# Altium schematic sheet btn_single_V1.0.SchDoc
size A4
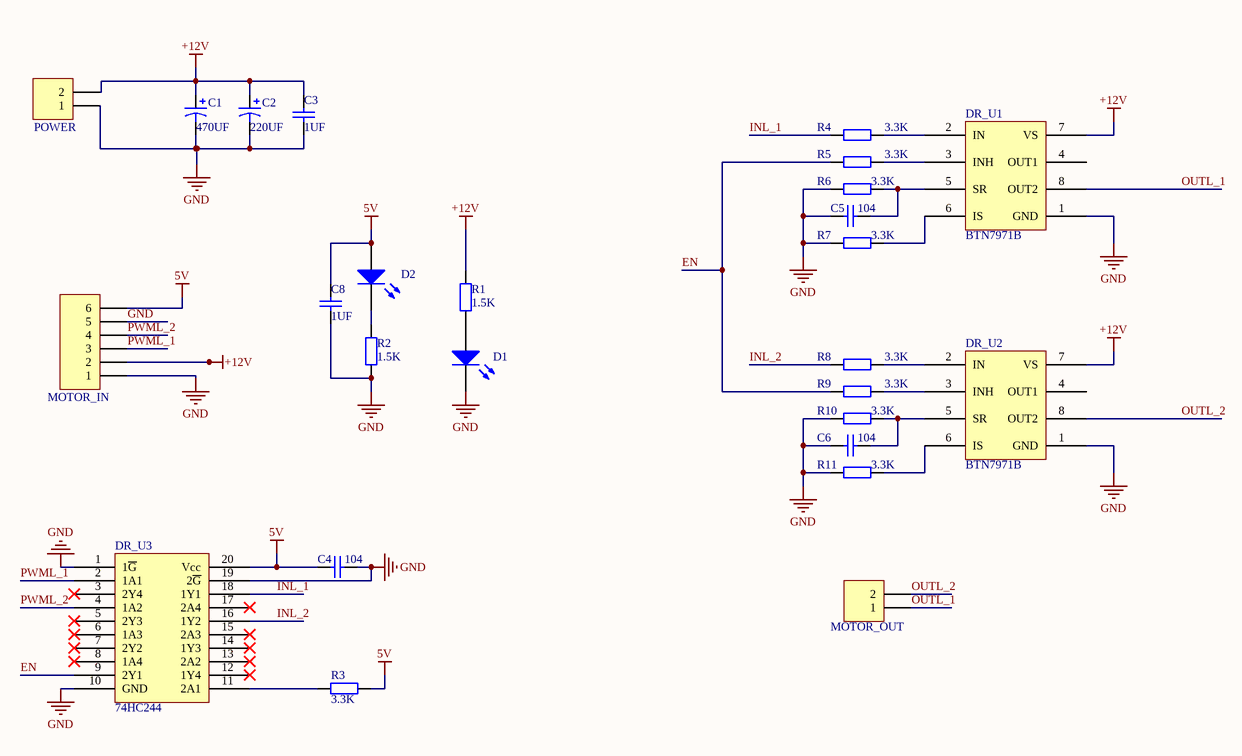
[diagram p0: btn_single_V1.0.SchDoc]

## Parts
C1  value 470UF  [CAP 5.0*10*12.5]  (hidden comment: Cap Pol1)
C2  value 220UF  [CAP 2.5*6.3*7]  (hidden comment: Cap Pol1)
C3  value 1UF  [C 0603_L]  (hidden comment: Cap)
C4  value 104  [C 0603_L]  (hidden comment: Cap)
C5  value 104  [C 0603_L]  (hidden comment: Cap)
C6  value 104  [C 0603_L]  (hidden comment: Cap)
C8  value 1UF  [C 0603_L]  (hidden comment: Cap)
D1  LED2  [0603LED B]  (value not drawn)
D2  LED2  [0603LED B]  (value not drawn)
DR_U1  BTN7971B  [BTN]
DR_U2  BTN7971B  [BTN]
DR_U3  74HC244  [SOP20_N]
MOTOR_IN  Header 6  [MX 1.25-WI-6P]  (value not drawn)
MOTOR_OUT  Header 2  [2PIN-5.08B]  (value not drawn)
POWER  Header 2  [2PIN-5.08B]  (value not drawn)
R1  value 1.5K  [R 0603_L]  (hidden comment: Res2)
R2  value 1.5K  [R 0603_L]  (hidden comment: Res2)
R3  value 3.3K  [R 0603_L]  (hidden comment: Res2)
R4  value 3.3K  [R 0603_L]  (hidden comment: Res2)
R5  value 3.3K  [R 0603_L]  (hidden comment: Res2)
R6  value 3.3K  [R 0603_L]  (hidden comment: Res2)
R7  value 3.3K  [R 0603_L]  (hidden comment: Res2)
R8  value 3.3K  [R 0603_L]  (hidden comment: Res2)
R9  value 3.3K  [R 0603_L]  (hidden comment: Res2)
R10  value 3.3K  [R 0603_L]  (hidden comment: Res2)
R11  value 3.3K  [R 0603_L]  (hidden comment: Res2)

## Nets
5V: C4.1 C8.1 D2.1(A) DR_U3.20(Vcc) MOTOR_IN.6 R3.2
+12V: C1.1 C2.1 C3.1 DR_U1.7(VS) DR_U2.7(VS) MOTOR_IN.2 POWER.2 R1.2
GND: C1.2 C2.2 C3.2 C4.2 C5.2 C6.2 C8.2 D1.2(K) DR_U1.1(GND) DR_U2.1(GND) DR_U3.1(1~{G}) DR_U3.10(GND) DR_U3.19(2~{G}) MOTOR_IN.1 MOTOR_IN.5 POWER.1 R2.1 R6.2 R7.1 R10.2 R11.1
EN: DR_U3.9(2Y1) R5.1 R9.1
INL_1: DR_U3.18(1Y1) R4.1
INL_2: DR_U3.16(1Y2) R8.1
OUTL_1: DR_U1.8(OUT2) MOTOR_OUT.1
OUTL_2: DR_U2.8(OUT2) MOTOR_OUT.2
PWML_1: DR_U3.2(1A1) MOTOR_IN.3
PWML_2: DR_U3.4(1A2) MOTOR_IN.4
NetC5_1: C5.1 DR_U1.5(SR) R6.1
NetC6_1: C6.1 DR_U2.5(SR) R10.1
NetD1_1: D1.1(A) R1.1
NetD2_2: D2.2(K) R2.2
NetDR_U1_2: DR_U1.2(IN) R4.2
NetDR_U1_3: DR_U1.3(INH) R5.2
NetDR_U1_6: DR_U1.6(IS) R7.2
NetDR_U2_2: DR_U2.2(IN) R8.2
NetDR_U2_3: DR_U2.3(INH) R9.2
NetDR_U2_6: DR_U2.6(IS) R11.2
NetDR_U3_11: DR_U3.11(2A1) R3.1

Not connected (* = marked no-connect by the designer): DR_U1 4(OUT1); DR_U2 4(OUT1); DR_U3 3(2Y4)* 5(2Y3)* 6(1A3)* 7(2Y2)* 8(1A4)* 12(1Y4)* 13(2A2)* 14(1Y3)* 15(2A3)* 17(2A4)*

## Library data of the parts
C1 C2 = Cap Pol1: Polarized Capacitor (Radial); Published: 8-Jun-2000; LatestRevisionDate: 17-Jul-2002; LatestRevisionNote: Re-released for DXP Platform.; PackageReference: RB7.6-15; Publisher: Altium Limited; PackageDescription: Polarized Capacitor (Radial); 2 Leads
C3-C6 C8 = Cap: Capacitor; Published: 8-Jun-2000; LatestRevisionDate: 17-Jul-2002; LatestRevisionNote: Re-released for DXP Platform.; PackageReference: RAD-0.3; Publisher: Altium Limited
D1 D2 = LED2: Typical RED, GREEN, YELLOW, AMBER GaAs LED; Published: 8-Jun-2000; LatestRevisionDate: 17-Jul-2002; LatestRevisionNote: Re-released for DXP Platform.; PackageDocument: Feb-2002; PackageReference: 3.2X1.6X1.1; Publisher: Altium Limited
MOTOR_IN = Header 6: Header, 6-Pin; LatestRevisionDate: 17-Jul-2002; LatestRevisionNote: Re-released for DXP Platform.; Publisher: Altium Limited
MOTOR_OUT POWER = Header 2: Header, 2-Pin; LatestRevisionDate: 17-Jul-2002; LatestRevisionNote: Re-released for DXP Platform.; Publisher: Altium Limited
R1-R11 = Res2: Resistor; Published: 8-Jun-2000; LatestRevisionDate: 17-Jul-2002; LatestRevisionNote: Re-released for DXP Platform.; PackageReference: AXIAL-0.4; Publisher: Altium Limited